# EAGLE design 16segment (EAGLE 6.4)
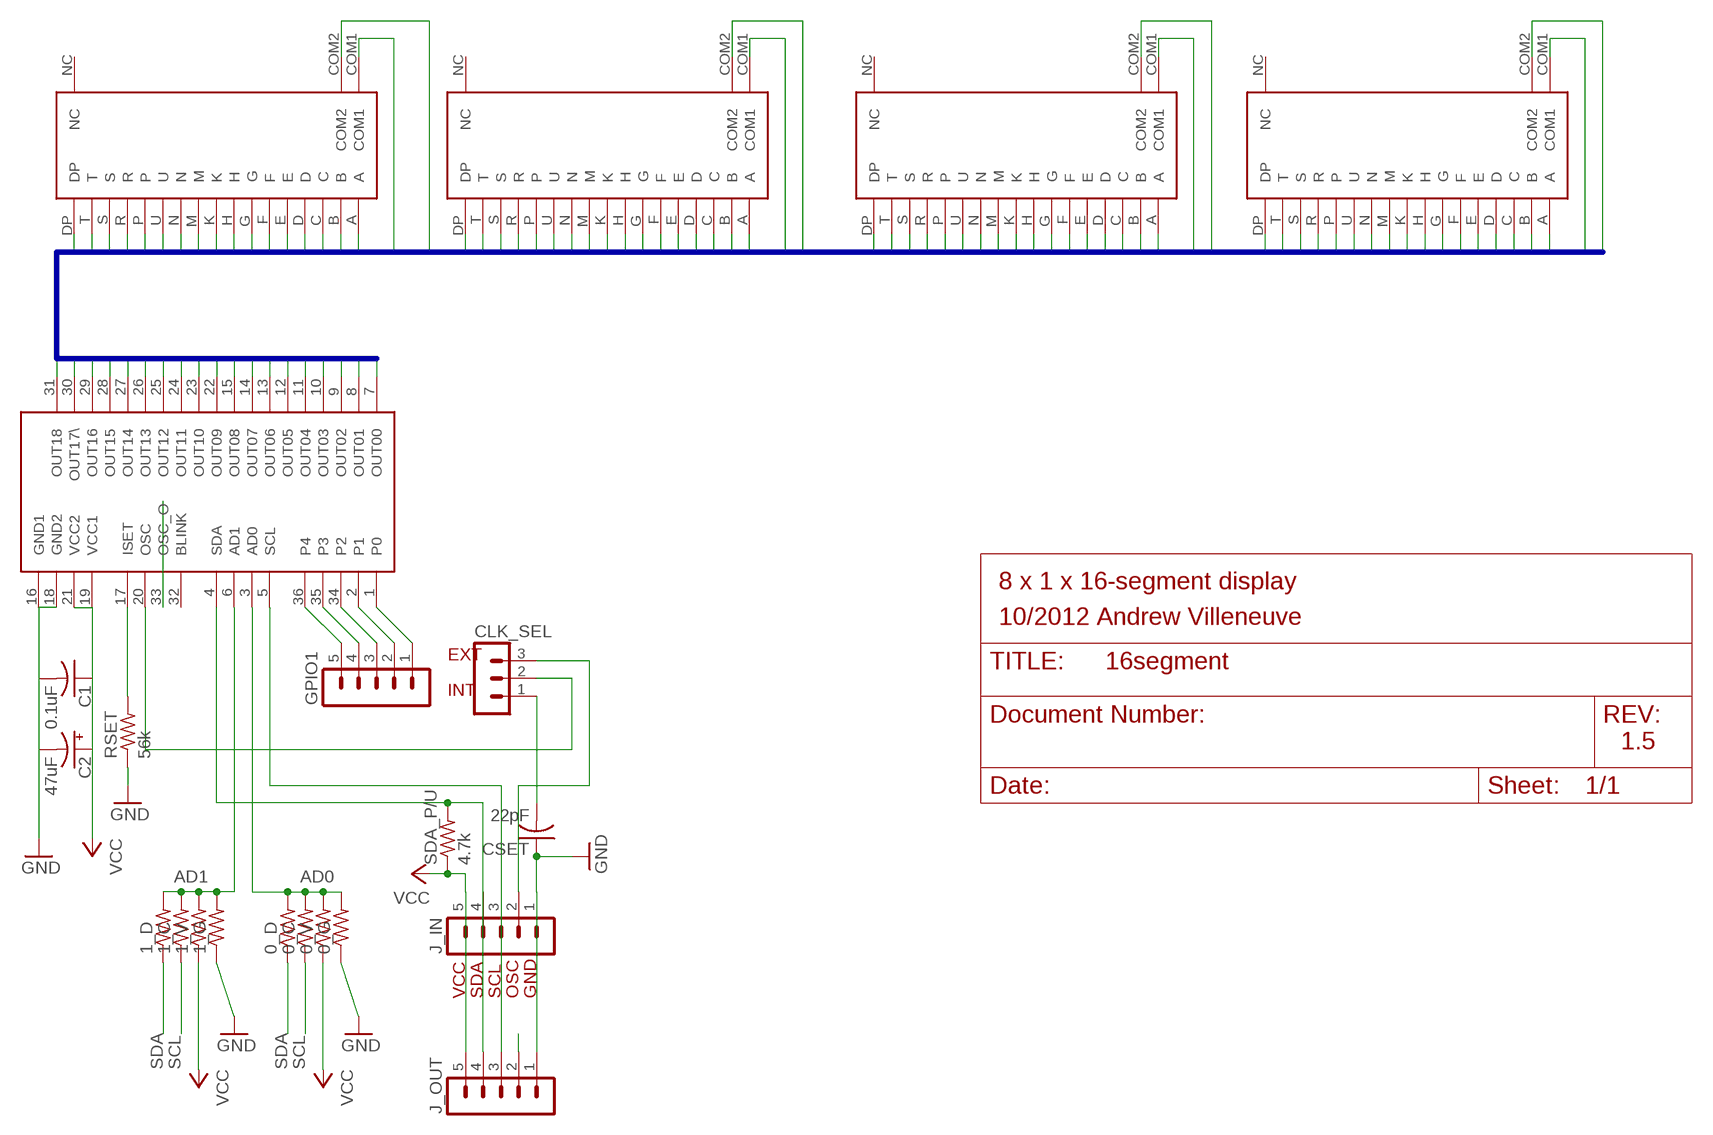
[diagram p0: schematic, sheet 1]

## Parts
0_C  R-US_R0805  [R0805]
0_D  R-US_R0805  [R0805]
0_G  R-US_R0805  [R0805]
0_V  R-US_R0805  [R0805]
1_C  R-US_R0805  [R0805]
1_D  R-US_R0805  [R0805]
1_G  R-US_R0805  [R0805]
1_V  R-US_R0805  [R0805]
C1  0.1uF  C-USC0805  [C0805]
C2  47uF  CPOL-USE2.5-6  [E2,5-6]
CLK_SEL  MA03-1  [MA03-1]
CSET  22pF  C-USC0805  [C0805]
DIGIT0,1  LTP-4323JD  [LTP-4323JD]
DIGIT2,3  LTP-4323JD  [LTP-4323JD]
DIGIT4,5  LTP-4323JD  [LTP-4323JD]
DIGIT6,7  LTP-4323JD  [LTP-4323JD]
GPIO1  MA05-1  [MA05-1]
IC1  MAX6955  [SSOP36]
J_IN  MA05-1  [MA05-1]
J_OUT  MA05-1  [MA05-1]
RSET  56k  R-US_R0805  [R0805]
SDA_P/U  4.7k  R-US_R0805  [R0805]

## Nets
AD0: 0_C.2 0_D.2 0_G.2 0_V.2 IC1.3(AD0)
AD1: 1_C.2 1_D.2 1_G.2 1_V.2 IC1.6(AD1)
EXT_OSC_IN: CLK_SEL.3 J_IN.2
GND: 0_G.1 1_G.1 C1.2 C2.- CSET.1 IC1.16(GND1) IC1.18(GND2) J_IN.1 J_OUT.1 RSET.1
GPIO_0: GPIO1.1 IC1.1(P0)
GPIO_1: GPIO1.2 IC1.2(P1)
GPIO_2: GPIO1.3 IC1.34(P2)
GPIO_3: GPIO1.4 IC1.35(P3)
GPIO_4: GPIO1.5 IC1.36(P4)
IC1_OSC: CLK_SEL.2 IC1.20(OSC)
INT_OSC: CLK_SEL.1 CSET.2
ISET: IC1.17(ISET) RSET.2
OSC_O: IC1.33(OSC_O) J_OUT.2
OUT0: DIGIT0,1.COM1 DIGIT2,3.A DIGIT4,5.A DIGIT6,7.A IC1.7(OUT00)
OUT1: DIGIT0,1.COM2 DIGIT2,3.B DIGIT4,5.B DIGIT6,7.B IC1.8(OUT01)
OUT2: DIGIT0,1.A DIGIT2,3.COM1 DIGIT4,5.C DIGIT6,7.C IC1.9(OUT02)
OUT3: DIGIT0,1.B DIGIT2,3.COM2 DIGIT4,5.D DIGIT6,7.D IC1.10(OUT03)
OUT4: DIGIT0,1.C DIGIT2,3.C DIGIT4,5.COM1 DIGIT6,7.E IC1.11(OUT04)
OUT5: DIGIT0,1.D DIGIT2,3.D DIGIT4,5.COM2 DIGIT6,7.F IC1.12(OUT05)
OUT6: DIGIT0,1.E DIGIT2,3.E DIGIT4,5.E DIGIT6,7.COM1 IC1.13(OUT06)
OUT7: DIGIT0,1.F DIGIT2,3.F DIGIT4,5.F DIGIT6,7.COM2 IC1.14(OUT07)
OUT8: DIGIT0,1.G DIGIT2,3.G DIGIT4,5.G DIGIT6,7.G IC1.15(OUT08)
OUT9: DIGIT0,1.H DIGIT2,3.H DIGIT4,5.H DIGIT6,7.H IC1.22(OUT09)
OUT10: DIGIT0,1.U DIGIT2,3.U DIGIT4,5.U DIGIT6,7.U IC1.23(OUT10)
OUT11: DIGIT0,1.P DIGIT2,3.P DIGIT4,5.P DIGIT6,7.P IC1.24(OUT11)
OUT12: DIGIT0,1.K DIGIT2,3.K DIGIT4,5.K DIGIT6,7.K IC1.25(OUT12)
OUT13: DIGIT0,1.M DIGIT2,3.M DIGIT4,5.M DIGIT6,7.M IC1.26(OUT13)
OUT14: DIGIT0,1.N DIGIT2,3.N DIGIT4,5.N DIGIT6,7.N IC1.27(OUT14)
OUT15: DIGIT0,1.R DIGIT2,3.R DIGIT4,5.R DIGIT6,7.R IC1.28(OUT15)
OUT16: DIGIT0,1.S DIGIT2,3.S DIGIT4,5.S DIGIT6,7.S IC1.29(OUT16)
OUT17: DIGIT0,1.T DIGIT2,3.T DIGIT4,5.T DIGIT6,7.T IC1.30(OUT17\)
OUT18: DIGIT0,1.DP DIGIT2,3.DP DIGIT4,5.DP DIGIT6,7.DP IC1.31(OUT18)
SCL: 0_C.1 1_C.1 IC1.5(SCL) J_IN.3 J_OUT.3
SDA: IC1.4(SDA) J_IN.4 J_OUT.4 SDA_P/U.2
SDA_0: 0_D.1 1_D.1
VCC: 0_V.1 1_V.1 C1.1 C2.+ IC1.19(VCC1) IC1.21(VCC2) J_IN.5 J_OUT.5 SDA_P/U.1
Unconnected: DIGIT0,1.NC DIGIT2,3.NC DIGIT4,5.NC DIGIT6,7.NC IC1.32(BLINK)

## Buses
OUT[0..18]

## Notes on the sheet
- 8 x 1 x 16-segment display
- 10/2012 Andrew Villeneuve
- EXT
- INT
- 1.5
- AD1 | AD0
- VCC | SDA | SCL | OSC | GND
- SDA | SCL | SDA | SCL

## Library data of the parts
0_C 0_D 0_G 0_V 1_C 1_D 1_G 1_V = resistor_custom:R-US_: RESISTOR, American symbol
C1 CSET = resistor:C-US: CAPACITOR, American symbol
C2 = resistor:CPOL-US: POLARIZED CAPACITOR, American symbol
CLK_SEL = con-lstb:MA03-1: PIN HEADER; OC_FARNELL: unknown; OC_NEWARK: unknown
DIGIT0,1 DIGIT2,3 DIGIT4,5 DIGIT6,7 = villeneuve:LTP-4323JD: LITE-ON LTP-4323JD 2 character, 16-segment alphanumeric LED display with 2 decimal places.
GPIO1 J_IN J_OUT = con-lstb:MA05-1: PIN HEADER; OC_FARNELL: unknown; OC_NEWARK: unknown
IC1 = maxim-led:MAX6955: 7, 14, 16 segment LED display driver
RSET SDA_P/U = resistor_custom2:R-US_: RESISTOR, American symbol

## Board
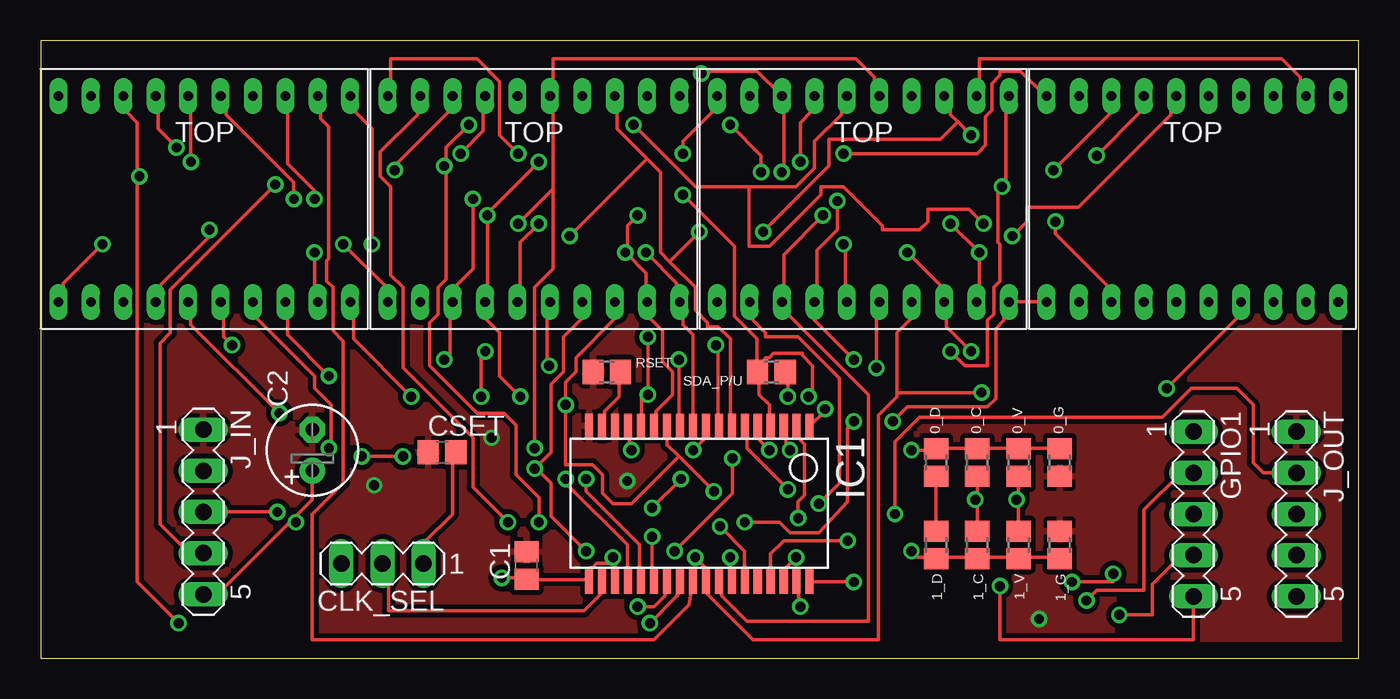
[diagram p1: board, top side]
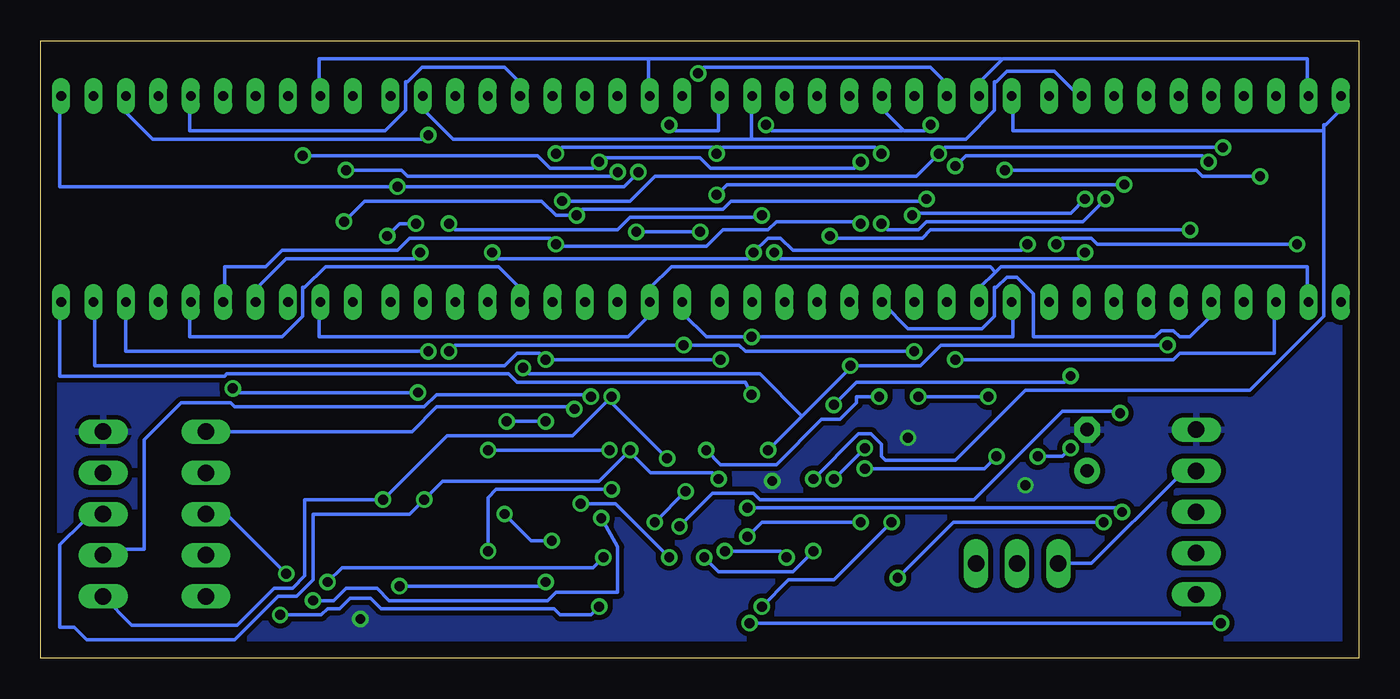
[diagram p2: board, bottom side, seen from below]

Size 81.33 x 38.09 mm. Coordinates in mm from the lower left corner, seen from the top.
Outline: 0,0 81.33,0 81.33,38.09 0,38.09 0,0
Copper layers (1*16): Top 0.035mm / dielectric 1.5mm / Bottom 0.035mm
Design rules "default *": minimum track width 8mil, minimum drill 24mil, track to track 12mil, track to pad 8mil, pad to pad 8mil, via to via 8mil, smd to smd 8mil, copper to edge 40mil, drill to drill 8mil, minimum pad ring 10mil, minimum via ring 8mil, stop-mask expansion 4mil, vias tented up to drill 0mil, thermal gap 10mil

### Footprints (pad centres in the part's own frame; a part is rotated, then mirrored left to right if it is on the bottom)
R0805 = smd 1.3 x 1.5: 1 -0.85,0; 2 0.85,0
C0805 = smd 1.3 x 1.5: 1 -0.85,0; 2 0.85,0
E2,5-6 = drill 0.813 pad 1.6: + -1.27,0 | drill 0.813 pad 1.6 octagon: - 1.27,0
MA03-1 = drill 1.016 long: 1 -2.54,0; 2 0,0; 3 2.54,0
LTP-4323JD = drill 0.6 long: A 15.1,14.35; B 19.1,14.35; C 7.1,14.35; COM1 7.1,1.65; COM2 19.1,1.65; D 15.1,1.65; DP 9.1,1.65; E 17.1,1.65; F 1.1,1.65; G 11.1,1.65; H 11.1,14.35; K 3.1,14.35; M 5.1,14.35; N 17.1,14.35; NC 13.1,14.35; P 9.1,14.35; R 13.1,1.65; S 5.1,1.65; T 3.1,1.65; U 1.1,14.35
MA05-1 = drill 1.016 long: 1 -5.08,0; 2 -2.54,0; 3 0,0; 4 2.54,0; 5 5.08,0
SSOP36 = smd 0.5 x 1.5: 1 -6.8,-4.8; 2 -6,-4.8; 3 -5.2,-4.8; 4 -4.4,-4.8; 5 -3.6,-4.8; 6 -2.8,-4.8; 7 -2,-4.8; 8 -1.2,-4.8; 9 -0.4,-4.8; 10 0.4,-4.8; 11 1.2,-4.8; 12 2,-4.8; 13 2.8,-4.8; 14 3.6,-4.8; 15 4.4,-4.8; 16 5.2,-4.8; 17 6,-4.8; 18 6.8,-4.8; 19 6.8,4.8; 20 6,4.8; 21 5.2,4.8; 22 4.4,4.8; 23 3.6,4.8; 24 2.8,4.8; 25 2,4.8; 26 1.2,4.8; 27 0.4,4.8; 28 -0.4,4.8; 29 -1.2,4.8; 30 -2,4.8; 31 -2.8,4.8; 32 -3.6,4.8; 33 -4.4,4.8; 34 -5.2,4.8; 35 -6,4.8; 36 -6.8,4.8

### Placement (x,y rotation side)
0_C  57.78,12.06 90 top
0_D  55.24,12.06 90 top
0_G  62.87,12.06 90 top
0_V  60.33,12.06 90 top
1_C  57.78,6.99 270 top
1_D  55.24,6.99 270 top
1_G  62.87,6.99 270 top
1_V  60.33,6.99 270 top
C1  29.97,5.71 90 top
C2  16.76,12.83 90 top
CLK_SEL  21.08,5.84 180 top
CSET  24.77,12.7 0 top
DIGIT0,1  0,20.32 0 top
DIGIT2,3  20.32,20.32 0 top
DIGIT4,5  40.64,20.32 0 top
DIGIT6,7  60.96,20.32 0 top
GPIO1  71.12,8.89 270 top
IC1  40.64,9.53 180 top
J_IN  10.03,9.02 270 top
J_OUT  77.47,8.89 270 top
RSET  34.92,17.65 0 top
SDA_P/U  45.09,17.65 180 top

### Tracks (layer width: path | path; a pad name or v marks a point on that pad's centre or on a via)
AD0  (via drill 0.61)
  Top 0.203: v46.23,12.83 45.97,13.08 45.97,14.1 45.85,14.22 IC1.3 | v53.72,12.83 55.24,12.83 0_D.2 55.24,12.95 57.78,12.95 | 57.78,12.95 60.33,12.95 | 57.78,12.95 0_C.2 | 60.33,12.95 62.87,12.95 0_G.2 | 60.33,12.95 0_V.2
  Bottom 0.203: v53.72,12.83 v46.23,12.83
AD1  (via drill 0.61)
  Top 0.203: 57.78,6.22 55.24,6.22 | v46.1,10.41 43.56,12.95 43.56,14.22 IC1.6 | v53.72,6.6 54.1,6.22 55.24,6.22 | 55.24,6.22 1_D.2 | 57.78,6.22 60.33,6.22 | 57.78,6.22 1_C.2 | 60.33,6.22 62.87,6.22 1_G.2 | 60.33,6.22 1_V.2
  Bottom 0.203: v46.1,10.41 53.21,10.41 53.72,9.91 v53.72,6.6
EXT_OSC_IN
  Bottom 0.203: J_IN.2 10.54,11.05 11.3,11.05 16.51,5.84 CLK_SEL.3
GND  (via drill 0.6)
  other vias: 61.59,2.41 20.57,10.67 36.2,10.92 27.81,13.59
  pour Bottom: 0,38.1 81.28,38.1 81.28,0 0,0
  pour Top: 0,38.1 81.28,38.1 81.28,0 0,0
GPIO_0  (via drill 0.61)
  Top 0.203: v48.39,15.37 48.39,15.24 47.5,14.35 IC1.1
  Bottom 0.203: v48.39,15.37 48.51,15.49 56.9,15.49 58.42,13.97 GPIO1.1
GPIO_1  (via drill 0.61)
  Top 0.203: v46.74,8.64 46.74,9.65 47.12,10.03 47.12,13.21 46.74,13.59 46.74,14.22 IC1.2 | v64.52,3.56 65.15,4.19 68.07,4.19 68.07,9.14 70.36,11.43 GPIO1.2
  Bottom 0.203: v46.74,8.64 45.72,6.86 45.72,4.06 49.53,4.06 50.04,3.56 59.82,3.56 60.58,4.32 62.48,4.32 63.25,3.56 v64.52,3.56
GPIO_2  (via drill 0.61)
  Top 0.203: v46.61,6.22 45.97,5.59 45.97,4.95 45.85,4.83 IC1.34 | v63.63,4.7 66.17,4.7 v66.17,5.21
  Bottom 0.203: v46.61,6.22 47.24,5.59 62.74,5.59 v63.63,4.7 | v66.17,5.21 69.85,8.89 GPIO1.3
GPIO_3  (via drill 0.61)
  Top 0.203: v46.86,3.17 46.74,4.06 46.74,4.7 IC1.35 | v66.55,2.67 68.58,2.67 68.58,4.57 70.36,6.35 GPIO1.4
  Bottom 0.203: v46.86,3.17 47.37,2.67 49.28,2.67 49.66,3.05 60.33,3.05 60.96,3.68 62.23,3.68 62.87,3.05 63.63,3.05 64.01,2.67 v66.55,2.67
GPIO_4  (via drill 0.61)
  Top 0.203: v50.16,4.7 47.5,4.7 IC1.36 | v59.18,4.45 59.18,1.14 71.12,1.14 GPIO1.5
  Bottom 0.203: v50.16,4.7 50.42,4.45 v59.18,4.45
IC1_OSC
  Top 0.203: CLK_SEL.2 21.46,5.46 21.46,2.92 33.53,2.92 34.67,4.06 34.54,4.7 IC1.20
INT_OSC
  Top 0.203: CLK_SEL.1 23.62,7.11 25.4,8.89 25.4,12.57 25.53,12.7 CSET.2
ISET
  Top 0.203: IC1.17 34.67,14.35 34.8,14.48 34.8,15.24 35.69,16.13 35.69,17.65 RSET.2
OSC_O  (via drill 0.6)
  Top 0.203: IC1.33 45.04,6.43 45.85,7.24 v49.78,7.24 | v52.7,8.89 52.7,13.34 54.23,14.86 69.22,14.86 70.99,16.64 73.79,16.64 74.8,15.62 74.8,12.06 75.44,11.43 J_OUT.2
  Bottom 0.203: v49.78,7.24 51.05,7.24 v52.7,8.89
OUT0  (via drill 0.61)
  Top 0.203: v57.4,32.26 56.58,33.08 | 56.58,33.08 56.13,33.53 56.13,34.16 55.75,34.54 DIGIT4,5.A | 38.8,24.45 38.23,25.02 38.23,29.97 37.4,30.8 | 38.8,24.45 40.39,22.86 40.39,21.46 41.15,20.7 41.15,20.45 41.78,20.45 42.55,19.68 42.55,14.35 IC1.7 | 37.4,30.8 35.56,32.64 35.56,33.66 35.43,33.78 35.43,34.54 DIGIT2,3.A | v10.41,26.42 10.41,26.04 7.37,22.99 7.37,22.23 7.11,21.97 DIGIT0,1.COM1 | 37.4,30.8 v32.64,26.04 | 56.58,33.08 55.5,32 48.64,32 48.64,30.35 v44.58,26.29 | 38.8,24.45 v40.64,26.29
  Bottom 0.203: v57.4,32.26 57.66,32 74.42,32 76.07,33.66 76.07,34.54 DIGIT6,7.A | v10.41,26.42 26.42,26.42 26.92,25.91 32.51,25.91 v32.64,26.04 | v40.64,26.29 v44.58,26.29
OUT1  (via drill 0.61)
  Top 0.203: v41.66,19.3 41.78,19.05 41.78,14.35 IC1.8 | v27.43,18.92 27.18,18.67 v27.18,16.13 | v22.86,16.13 19.3,19.68 19.3,20.95 19.18,21.08 19.18,21.84 DIGIT0,1.COM2 | v42.55,32.89 44.45,30.99 v44.45,29.97 | DIGIT4,5.B 59.69,34.54 59.69,33.78 59.56,33.66 59.56,29.34 v59.31,29.08 59.05,28.83 59.05,25.65 59.18,25.53 59.18,23.24 58.8,22.86 58.8,21.21 58.42,20.83 58.42,18.03 57.02,18.03 v56.13,18.92
  Bottom 0.203: v27.43,18.92 37.85,18.92 38.23,19.3 v41.66,19.3 55.75,19.3 v56.13,18.92 | v22.86,16.13 v27.18,16.13 | v42.55,32.89 42.16,32.51 39.5,32.51 39.5,34.54 DIGIT2,3.B | v44.45,29.97 45.34,29.08 v59.31,29.08 80.14,29.08 80.14,34.54 DIGIT6,7.B
OUT2  (via drill 0.61)
  Top 0.203: v40.26,12.83 40.89,13.46 40.89,14.1 41.02,14.22 IC1.9 | v29.59,16.13 28.32,17.4 28.32,20.07 27.43,20.95 27.43,21.84 DIGIT2,3.COM1 27.43,21.97 27.43,22.86 27.56,22.99 v27.56,27.3 27.56,27.43 v30.73,30.61 | v16.89,28.32 16.89,28.83 15.24,30.48 15.24,34.42 15.11,34.54 DIGIT0,1.A | v46.86,30.61 46.86,33.02 47.5,33.66 47.5,34.42 47.62,34.54 DIGIT4,5.C | v65.15,30.99 67.82,33.66 67.82,34.42 67.94,34.54 DIGIT6,7.C
  Bottom 0.203: v40.26,12.83 39.37,11.94 35.94,11.94 33.15,14.73 32,14.73 30.99,15.75 30.99,16.13 v29.59,16.13 | v16.89,28.32 17.78,27.43 27.43,27.43 v27.56,27.3 | v30.73,30.61 31.11,30.23 40.01,30.23 40.64,30.86 46.61,30.86 v46.86,30.61 47.24,30.23 49.91,30.23 50.67,30.99 v65.15,30.99
OUT3  (via drill 0.61)
  Top 0.203: IC1.10 40.26,14.35 40.26,19.94 39.62,20.57 39.62,20.95 39.5,21.08 39.5,21.84 DIGIT2,3.COM2 39.37,21.97 39.37,22.86 39.24,22.99 39.24,23.11 v37.34,25.02 | v20.45,25.53 20.45,32.64 19.43,33.66 19.43,34.29 19.18,34.54 DIGIT0,1.B | v53.47,25.02 55.5,22.99 55.5,22.1 55.63,21.97 DIGIT4,5.D 55.75,21.84 55.75,21.08 55.88,20.95 55.88,20.45 v57.4,18.92
  Bottom 0.203: v20.45,25.53 20.83,25.15 34.92,25.15 35.69,25.91 36.45,25.91 v37.34,25.02 37.72,24.64 53.09,24.64 v53.47,25.02 | v57.4,18.92 76.07,18.92 76.07,21.84 DIGIT6,7.D
OUT4  (via drill 0.61)
  Top 0.203: v8.38,31.5 7.24,32.64 7.24,34.42 7.11,34.54 DIGIT0,1.C | v25.91,31.11 27.3,32.51 27.3,34.54 DIGIT2,3.C | v39.37,18.41 39.37,14.35 IC1.11 | v50.16,18.41 47.75,20.83 47.75,21.84 DIGIT4,5.COM1 47.75,21.97 47.75,22.86 47.88,22.99 47.88,25.15 49.15,26.42 v49.15,28.19
  Bottom 0.203: v8.38,31.5 25.53,31.5 v25.91,31.11 27.3,29.72 43.43,29.72 44.96,28.19 v49.15,28.19 | v39.37,18.41 v50.16,18.41 50.55,18.8 51.94,18.8 52.7,18.03 77.98,18.03 77.98,21.84 DIGIT6,7.E
OUT5  (via drill 0.61)
  Top 0.203: DIGIT6,7.F 61.98,21.97 59.82,21.97 DIGIT4,5.COM2 59.69,21.84 59.44,21.59 59.44,20.83 58.93,20.32 58.93,16 58.42,15.49 53.47,15.49 v52.58,14.61 | 38.48,14.1 38.61,14.22 IC1.12 38.64,13.14 38.67,13.14 39.37,12.45 | DIGIT2,3.D 35.43,21.84 35.43,20.95 33.02,18.54 33.02,17.65 32.38,17.02 v32.38,15.62 32.38,11.94 34.04,11.94 34.67,11.3 34.67,10.16 35.31,9.53 36.45,9.53 39.37,12.45 | v17.78,17.4 15.24,19.94 15.24,21.72 15.11,21.84 DIGIT0,1.D | v50.16,14.61 49.78,14.22 49.78,9.65 48.01,7.75 46.23,7.75 45.59,8.38 v43.43,8.38 | 39.37,12.45 v41.53,10.29
  Bottom 0.203: v17.78,17.4 18.16,17.02 30.99,17.02 v32.38,15.62 | v50.16,14.61 v52.58,14.61 | v41.53,10.29 v43.43,8.38
OUT6  (via drill 0.61)
  Top 0.203: DIGIT4,5.E 57.78,21.97 57.91,22.1 v57.91,25.02 v56.13,26.8 | IC1.13 37.85,14.35 37.97,14.48 37.97,15.24 38.99,16.26 38.99,17.65 38.35,18.29 38.35,20.19 37.47,21.08 37.47,21.84 DIGIT2,3.E 37.34,21.97 37.34,23.75 v36.07,25.02 36.2,25.02 36.2,26.67 v36.83,27.3 | v16.89,25.02 16.89,22.1 17.02,21.97 DIGIT0,1.E
  Bottom 0.203: v57.91,25.02 58.29,24.64 66.17,24.64 67.94,22.86 67.94,21.97 DIGIT6,7.COM1 | v16.89,25.02 17.27,24.64 35.69,24.64 v36.07,25.02 | v56.13,26.8 55.75,26.42 45.72,26.42 44.96,27.18 36.96,27.18 v36.83,27.3
OUT7  (via drill 0.61)
  Top 0.203: v3.81,25.53 1.4,23.11 1.4,22.23 1.14,21.97 DIGIT0,1.F | v18.67,25.53 21.34,22.86 21.34,21.97 DIGIT2,3.F | v37.47,19.81 v37.47,16.26 37.47,16.38 37.08,16 37.08,14.35 IC1.14
  Bottom 0.203: v3.81,25.53 16.13,25.53 16.51,25.91 18.29,25.91 v18.67,25.53 | DIGIT4,5.F 41.66,21.84 41.66,21.21 40.26,19.81 v37.47,19.81 21.34,19.81 21.34,21.84 DIGIT2,3.F | v37.47,16.26 37.85,17.02 51.94,17.02 52.45,17.53 69.85,17.53 69.98,17.4 80.14,17.4 80.14,21.84 DIGIT6,7.COM2
OUT8  (via drill 0.61)
  Top 0.203: v36.45,12.83 36.32,12.95 36.32,14.22 IC1.15 | v31.37,18.03 31.24,18.16 31.24,20.95 31.37,21.08 31.37,21.84 DIGIT2,3.G | v11.81,19.3 11.3,19.81 11.3,21.72 11.18,21.84 DIGIT0,1.G | v51.56,17.91 51.56,21.72 51.69,21.84 DIGIT4,5.G
  Bottom 0.203: 34.35,14.92 31.37,17.91 v31.37,18.03 27.05,18.03 25.78,19.3 v11.81,19.3 | 34.35,14.92 v36.45,12.83 | v51.56,17.91 51.18,17.53 36.96,17.53 34.35,14.92 | DIGIT6,7.G 72.14,21.84 72.14,19.81 66.42,19.81 65.15,21.08 65.15,22.86 65.02,22.86 63.75,24.13 53.09,24.13 51.82,22.86 51.82,21.97 DIGIT4,5.G
OUT9  (via drill 0.61)
  Top 0.203: v32.38,11.05 32.38,10.79 36.2,6.99 36.2,4.83 IC1.22 | v30.48,12.95 30.48,22.86 31.62,24 31.62,28.96 | 31.62,28.96 31.62,33.66 31.5,33.78 31.5,34.54 DIGIT2,3.H 31.62,33.78 31.62,36.96 50.29,36.96 51.44,35.81 51.44,34.92 51.69,34.67 DIGIT4,5.H | v15.62,28.32 15.62,29.34 11.43,33.53 11.43,34.29 11.18,34.54 DIGIT0,1.H | 31.62,28.96 v29.46,26.8
  Bottom 0.203: v30.48,12.95 v32.38,11.05 | v15.62,28.32 17.02,26.92 26.67,26.92 27.18,26.42 29.08,26.42 v29.46,26.8 | DIGIT6,7.H 72.14,34.54 72.14,32.51 60.07,32.51 58.8,33.78 58.8,35.56 58.67,35.56 57.78,36.45 52.7,36.45 51.82,35.56 51.82,34.67 DIGIT4,5.H
OUT10  (via drill 0.61)
  Top 0.203: v33.66,11.05 33.66,10.29 36.96,6.99 36.96,4.83 IC1.23 | v39.62,31.11 39.62,31.88 41.4,33.66 41.4,34.29 41.66,34.54 DIGIT4,5.U | v29.46,31.11 28.32,32.26 28.32,35.56 26.92,36.96 21.59,36.96 21.59,35.69 21.46,35.56 21.46,34.67 DIGIT2,3.U | v49.53,31.11 57.78,31.11 58.29,31.62 58.29,33.4 58.67,33.78 58.67,35.43 59.18,35.94 59.18,36.2 60.45,36.2 61.98,34.67 DIGIT6,7.U
  Bottom 0.203: v33.66,11.05 30.86,13.84 30.1,13.84 29.46,13.21 29.46,12.45 29.21,12.19 24.89,12.19 20.57,16.51 6.73,16.51 2.16,21.08 2.16,32.51 | 2.16,32.51 2.16,32.89 2.03,32.89 1.14,33.78 1.14,34.54 DIGIT0,1.U | 2.16,32.51 21.34,32.51 21.34,34.54 DIGIT2,3.U | v29.46,31.11 29.84,31.5 39.24,31.5 v39.62,31.11 39.37,31.5 49.15,31.5 v49.53,31.11
OUT11  (via drill 0.61)
  Top 0.203: v37.72,7.49 37.72,4.83 IC1.24 | v30.73,8.38 30.73,9.91 29.34,11.3 29.34,14.35 28.57,15.11 26.92,15.11 24,18.03 24,20.7 24.51,21.21 24.51,22.86 25.02,23.37 25.02,30.35 | 25.02,30.35 25.02,31.5 v26.42,32.89 | v9.27,30.61 9.27,34.42 9.14,34.54 DIGIT0,1.P | 25.02,30.35 v24.89,30.35 | 43.69,29.08 40.39,29.08 v36.58,32.89 | 43.69,29.08 46.61,29.08 47.75,30.23 47.75,31.88 49.4,33.53 49.4,34.29 49.66,34.54 DIGIT4,5.P | v59.94,26.04 60.83,26.92 60.83,27.81 64.01,27.81 69.72,33.53 69.72,34.29 69.98,34.54 DIGIT6,7.P | v58.17,26.8 57.28,27.69 54.74,27.69 54.74,26.92 54.23,26.42 51.94,26.42 51.94,26.67 49.53,29.08 48.13,29.08 48.13,28.57 44.96,25.4 43.69,25.4 43.69,29.08
  Bottom 0.203: v37.72,7.49 36.83,8.38 v30.73,8.38 | v26.42,32.89 26.8,32.51 28.07,32.51 28.13,32.58 | 28.13,32.58 29.34,33.78 29.34,34.54 DIGIT2,3.P | v9.27,30.61 9.65,30.99 24.26,30.99 v24.89,30.35 | v36.58,32.89 36.2,32.51 28.19,32.51 28.13,32.58 | v59.94,26.04 59.18,26.8 v58.17,26.8
OUT12  (via drill 0.61)
  Top 0.203: v36.83,3.17 37.85,3.17 38.48,3.81 38.61,4.06 38.61,4.7 IC1.25 | v28.83,8.38 26.67,10.54 26.67,13.59 22.35,17.91 22.35,22.86 21.59,23.62 21.59,29.08 20.95,29.72 20.95,31.24 23.24,33.53 23.24,33.66 23.37,33.78 23.37,34.54 DIGIT2,3.K
  Bottom 0.203: v36.83,3.17 35.18,4.83 32.38,4.83 v28.83,8.38 | 22.04,36.89 23.37,35.56 23.37,34.67 DIGIT2,3.K | 22.04,36.89 21.97,36.96 3.17,36.96 3.17,34.67 DIGIT0,1.K | 43.81,36.96 43.81,34.67 DIGIT4,5.K | 43.81,36.96 22.1,36.96 22.04,36.89 | 43.81,36.96 64.14,36.96 64.14,34.67 DIGIT6,7.K
OUT13  (via drill 0.61)
  Top 0.203: v45.72,29.97 45.85,30.1 45.85,34.54 DIGIT4,5.M 45.72,34.67 44.2,36.2 40.77,36.2 v40.77,36.07 | v62.48,30.1 66.04,33.66 66.04,34.54 DIGIT6,7.M | v37.59,2.16 39.24,3.81 39.37,4.06 39.37,4.7 IC1.26 | v8.51,2.16 5.97,4.7 5.97,29.72 | 5.97,29.72 5.97,33.02 5.21,33.78 5.21,34.54 DIGIT0,1.M | v21.84,30.1 21.84,30.35 25.15,33.66 25.15,34.29 25.4,34.54 DIGIT2,3.M | 5.97,29.72 v6.1,29.72
  Bottom 0.203: v45.72,29.97 45.97,29.72 58.67,29.72 59.05,30.1 v62.48,30.1 | v8.51,2.16 v37.59,2.16 | v21.84,30.1 10.03,30.1 9.65,29.72 v6.1,29.72 | v40.77,36.07 40.39,36.45 26.42,36.45 25.53,35.56 25.53,34.67 DIGIT2,3.M
OUT14
  Top 0.203: DIGIT6,7.N 77.98,34.67 77.72,34.92 77.72,35.81 76.58,36.96 57.91,36.96 57.91,35.69 57.78,35.56 57.78,34.67 DIGIT4,5.N | IC1.27 40.13,4.7 40.13,4.06 40.01,3.3 37.85,1.14 16.76,1.14 16.76,8.89 18.67,10.79 18.67,19.56 18.03,20.19 18.03,22.86 17.65,23.24 17.65,24.51 17.78,24.64 17.78,32.77 17.27,33.27 17.27,33.66 17.14,33.78 17.14,34.54 DIGIT0,1.N
  Bottom 0.203: 37.47,32 37.47,34.54 DIGIT2,3.N | 37.47,32 55.88,32 57.66,33.78 57.66,34.54 DIGIT4,5.N | 37.47,32 24.26,32 22.48,33.78 22.48,35.56 22.35,35.56 21.72,36.2 18.8,36.2 17.27,34.67 17.14,34.67 DIGIT0,1.N
OUT15  (via drill 0.61)
  Top 0.203: v17.78,12.95 17.91,13.08 17.91,15.62 16.89,16.64 16.89,17.4 13.34,20.95 13.34,21.72 13.21,21.84 DIGIT0,1.R | v22.35,12.45 v19.81,12.45 | DIGIT2,3.R 33.4,21.84 33.4,20.95 32.26,19.81 32.26,17.65 31.5,16.89 31.5,12.7 v30.48,11.68 30.61,11.68 31.5,10.79 31.5,8.76 v33.66,6.6 | 52.83,16.38 52.83,20.07 53.72,20.95 53.72,21.84 DIGIT4,5.R | 52.83,16.38 52.83,16.13 51.69,14.99 51.69,1.14 43.94,1.14 41.15,3.94 41.15,4.7 IC1.28 41.02,4.83 41.02,5.59 v40.39,6.22 | v69.47,16.64 73.79,20.95 73.79,21.59 74.04,21.84 DIGIT6,7.R | 52.83,16.38 v58.04,16.38
  Bottom 0.203: v17.78,12.95 18.29,12.45 v19.81,12.45 | v22.35,12.45 23.11,11.68 v30.48,11.68 | v69.47,16.64 69.22,16.38 v58.04,16.38 | v33.66,6.6 34.92,5.33 39.5,5.33 v40.39,6.22
OUT16  (via drill 0.61)
  Top 0.203: v24.89,18.41 25.27,18.8 25.27,20.95 25.4,21.08 25.4,21.84 DIGIT2,3.S 25.53,21.97 25.65,22.1 25.65,22.99 26.67,24 v26.67,28.32 | IC1.29 41.91,4.7 41.91,4.06 42.04,3.81 43.56,2.29 51.05,2.29 51.05,16.26 45.85,21.46 45.85,21.84 DIGIT4,5.S 45.85,21.97 45.85,24.89 v48.26,27.3 | v62.61,26.92 62.61,26.16 65.79,22.99 65.79,22.23 66.04,21.97 DIGIT6,7.S
  Bottom 0.203: v24.89,18.41 11.43,18.41 11.05,18.8 5.21,18.8 5.21,21.84 DIGIT0,1.S | v62.61,26.92 61.34,28.19 50.42,28.19 49.53,27.3 v48.26,27.3 47.88,27.69 39.24,27.69 38.73,28.19 26.8,28.19 v26.67,28.32
OUT17  (via drill 0.61)
  Top 0.203: v42.55,6.22 42.55,4.83 IC1.30 | v48.01,9.53 49.28,10.79 49.28,17.27 46.74,19.81 44.7,19.81 44.7,20.07 43.94,20.83 43.94,20.95 43.81,21.08 43.81,21.84 DIGIT4,5.T
  Bottom 0.203: 22.42,23.81 23.37,22.86 23.37,21.97 DIGIT2,3.T | 22.42,23.81 22.1,24.13 3.17,24.13 3.17,21.97 DIGIT0,1.T | v42.55,6.22 45.85,9.53 v48.01,9.53 | DIGIT6,7.T 64.14,21.84 64.14,19.81 45.09,19.81 43.81,21.08 43.81,21.84 DIGIT4,5.T 43.69,21.97 43.69,22.86 42.42,24.13 22.73,24.13 22.42,23.81
OUT18  (via drill 0.61)
  Top 0.203: v30.73,26.8 29.59,25.65 29.59,22.1 29.46,21.97 DIGIT2,3.DP | v49.53,25.53 49.66,25.4 49.66,21.97 DIGIT4,5.DP | v41.91,8.13 43.43,6.6 43.43,4.83 IC1.31 | v14.73,15.11 9.27,20.57 9.27,20.95 9.14,21.08 9.14,21.84 DIGIT0,1.DP
  Bottom 0.203: v30.73,26.8 30.86,26.92 35.94,26.92 36.45,26.42 39.24,26.42 40.26,25.4 49.4,25.4 v49.53,25.53 49.91,25.91 58.55,25.91 59.31,25.15 66.42,25.15 67.44,24.13 69.98,24.13 69.98,21.97 DIGIT6,7.DP | v41.91,8.13 39.88,10.16 37.34,10.16 36.96,9.78 23.75,9.78 18.29,15.24 14.86,15.24 v14.73,15.11 | DIGIT2,3.DP 29.34,21.84 27.81,20.32 23.24,20.32 22.48,21.08 22.48,22.86 22.35,22.86 21.72,23.5 21.08,23.5 20.07,22.48 20.07,19.81 12.57,19.81 12.19,20.19 11.43,20.19 11.05,19.81 10.41,19.81 9.14,21.08 9.14,21.84 DIGIT0,1.DP
SCL  (via drill 0.61)
  Top 0.203: 0_C.1 57.78,9.78 | 57.78,9.78 1_C.1 | v44.96,12.83 44.32,13.46 44.32,14.22 IC1.5 | 57.78,9.78 v57.66,9.78 | v14.61,9.02 J_IN.3 | v39.5,11.05 v37.72,9.27
  Bottom 0.203: v14.61,9.02 14.86,9.27 v37.72,9.27 | v39.5,11.05 39.88,11.43 43.69,11.43 44.96,12.7 v44.96,12.83 46.86,10.92 56.52,10.92 v57.66,9.78 58.55,8.89 64.52,8.89 64.52,4.83 65.53,3.81 66.67,3.81 69.34,1.14 78.49,1.14 79.25,1.91 80.14,1.91 80.14,6.99 78.74,8.38 77.98,8.38 J_OUT.3
SDA  (via drill 0.61)
  Top 0.203: 44.32,17.65 44.32,16.26 44.96,15.62 44.96,14.35 IC1.4 | 44.32,17.65 44.7,18.54 44.96,18.54 45.21,18.8 46.99,18.8 46.99,18.67 47.62,18.03 47.62,16.38 v47.37,16.13 | 44.32,17.65 SDA_P/U.2 44.2,17.65 44.2,19.68 42.8,21.08 42.8,25.4 v39.62,28.57 | J_IN.4 8.76,6.48 8.76,6.86 7.37,8.26 7.37,19.43 8,20.07 8,22.73 v14.48,29.21
  Bottom 0.203: v47.37,16.13 47.5,16.26 56.9,16.26 57.66,15.49 69.34,15.49 69.6,15.75 72.64,15.75 74.93,13.46 74.93,6.73 77.09,6.73 J_OUT.4 | v14.48,29.21 38.99,29.21 v39.62,28.57
SDA_0
  Top 0.203: 0_D.1 1_D.1
VCC  (via drill 0.61)
  Top 0.203: 35.31,5.84 35.43,5.84 35.43,4.83 IC1.21 | 35.31,5.84 34.29,5.84 34.04,5.59 33.91,5.59 33.91,4.83 IC1.19 33.78,4.83 29.97,4.83 C1.1 29.97,4.95 v28.45,4.95 | J_IN.5 11.3,3.94 11.3,4.32 15.56,8.57 | 15.56,8.57 16.76,9.78 C2.+ | 15.56,8.57 v15.75,8.38 | 0_V.1 60.33,9.78 | 60.33,9.78 1_V.1 | v46.1,16.13 46.1,17.53 45.97,17.65 SDA_P/U.1 | 60.33,9.78 v60.2,9.78 | v35.31,6.22 35.31,5.84 | v39.12,6.6 42.67,10.16 v42.67,12.32
  Bottom 0.203: v28.45,4.95 25.02,8.38 v15.75,8.38 | J_OUT.5 75.69,2.03 69.22,2.03 66.93,4.32 65.79,4.32 65.02,5.08 65.02,9.78 v60.2,9.78 56.26,13.72 48.51,13.72 v46.1,16.13 46.23,15.88 v42.67,12.32 | v35.31,6.22 35.69,6.6 v39.12,6.6

### Text on the board
tDocu: v1.5 | GND | CLK | EXT | INT | SCL | SDA | VCC | A. VILLENEUVE 2012
bDocu: 2013-01-08 | VCC | SDA | SCL | CLK | GND